# Altium schematic sheet Integration_Power.SchDoc
size A; SheetNumber: 1; SheetTotal: 1
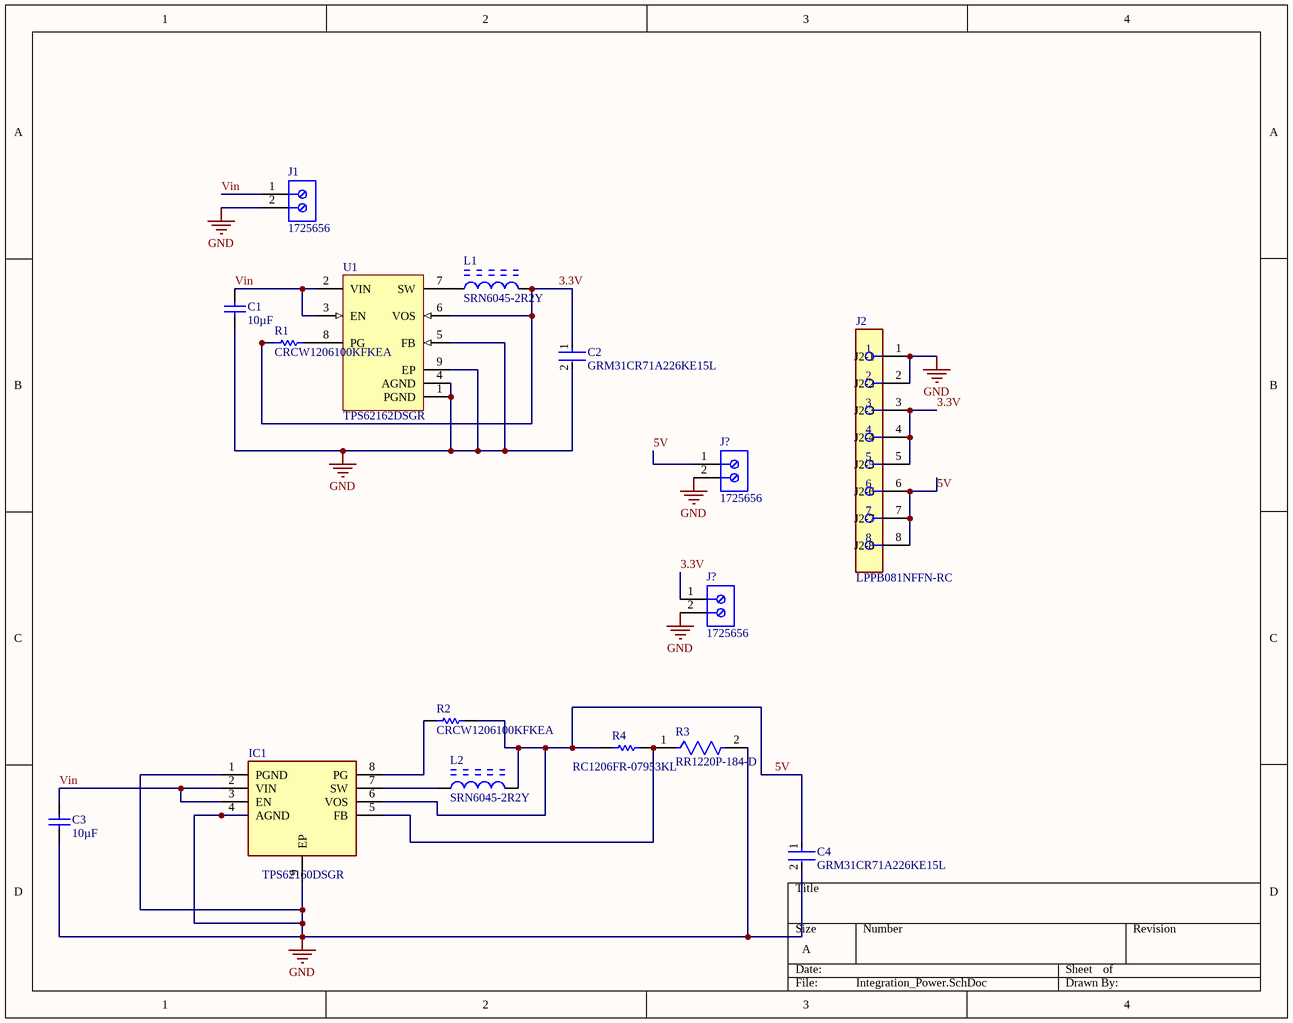
[diagram p0: Integration_Power.SchDoc]

## Parts
(Parts that share a designator on the sheet are numbered #1, #2 ... from top to bottom, then left to right.)
C1  Capacitance: 10µF  [CAPC3216X180X55LL20T25]  (hidden comment: GRM31CR71C106KAC7L)
C2  GRM31CR71A226KE15L  [FP-GRM31C-0_2-e0_3_0_8-MFG]
C3  Capacitance: 10µF  [CAPC3216X180X55LL20T25]  (hidden comment: GRM31CR71C106KAC7L)
C4  GRM31CR71A226KE15L  [FP-GRM31C-0_2-e0_3_0_8-MFG]
IC1  TPS62160DSGR  [SON50P200X200X80-9N]
J1  1725656  [PHOE-1725656-2]
J2  LPPB081NFFN-RC  [FP-LPPB081NFFN-RC-MFG]
J?#1  1725656  [PHOE-1725656-2]
J?#2  1725656  [PHOE-1725656-2]
L1  SRN6045-2R2Y  [BOUR-SRN6045_V]
L2  SRN6045-2R2Y  [BOUR-SRN6045_V]
R1  CRCW1206100KFKEA  [RESC3216X60X45NL10T20]
R2  CRCW1206100KFKEA  [RESC3216X60X45NL10T20]
R3  RR1220P-184-D  [FP-RR1220-IPC_B]
R4  RC1206FR-07953KL  [RESC3116X65X40NL10T20]
U1  TPS62162DSGR  [DSG0008A_V]

## Nets
GND: C1.1 C2.2 C3.1 C4.2 IC1.1(PGND) IC1.4(AGND) IC1.9(EP) J1.2 J2.1(J2-1) J2.2(J2-2) J?#1.2 J?#2.2 R3.2 U1.1(PGND) U1.4(AGND) U1.5(FB) U1.9(EP)
3.3V: C2.1 J2.3(J2-3) J2.4(J2-4) J2.5(J2-5) J?#2.1 L1.2 R1.1 U1.6(VOS)
5V: C4.1 IC1.6(VOS) J2.6(J2-6) J2.7(J2-7) J2.8(J2-8) J?#1.1 L2.2 R2.2 R4.1
Vin: C1.2 C3.2 IC1.2(VIN) IC1.3(EN) J1.1 U1.2(VIN) U1.3(EN)
NetIC1_5: IC1.5(FB) R3.1 R4.2
NetIC1_7: IC1.7(SW) L2.1
NetIC1_8: IC1.8(PG) R2.1
NetL1_1: L1.1 U1.7(SW)
NetR1_2: R1.2 U1.8(PG)

## Library data of the parts
C1 C3 = CMP-2000-06352-1: Chip Capacitor, 10 uF, +/- 10%, 16 V, -55 to 125 degC, 1206 (3216 Metric), RoHS, Tape and Reel; Manufacturer: Murata; Other Names: 490-3911-6; Product Training Modules: High-CapMultilayerCeramicCapacitors; Temperature Coefficient: X7R; Catalog Drawings: GRMSeries_1206_1.6; Featured Product: GA3SafetyRecognizedCapsandHi-CapMLCC; Online Catalog: GRMSeries; Voltage - Rated: 16V; Size / Dimension: 0.126"Lx0.063"W(3.20mmx1.60mm); Applications: GeneralPurpose; Package Description: 2-Pin Surface Mount Device, Body 3.2 x 1.6 mm; Datasheet Version: 03/2016; Package Reference: 1206; Manufacturer URL: http://www.murata.com/; Standard Package: 1; Mounting Type: SurfaceMount,MLCC; Thickness (Max): 0.071"(1.80mm); Category: Capacitors; Family: CeramicCapacitors; Lead Spacing: -; Tolerance: ±10%; Packaging: Digi-Reel®; Lead Style: -; Package / Case: 1206(3216Metric); Datasheet URL: http://search.murata.co.jp/Ceramy/image/img/A01X/G101/ENG/GRM31CR71C106KAC7-01.pdf; Operating Temperature: -55°C~125°C; Mounting Technology: SurfaceMount; Series: GRM; Ratings: -; Height - Seated (Max): -; Features: -; Parameter 1: *
C2 C4 = CMP-06035-003841-1: Chip Multilayer Ceramic Capacitors for General Purpose, 1206, 22uF, X7R, 15%, 10%, 10V; Height: 1.6mm; Width: 0.063inch; Min Operating Temperature: -55°C; Package Quantity: 1; Termination: SMD/SMT; Length: 3.2mm; Voltage Rating: 10V; Case/Package: 1206; Capacitance: 22uF; Case Code (Imperial): 1206; Depth: 1.6mm; Dielectric: X7R; Voltage: 10V; Material: Ceramic; Tolerance: 10%; Voltage Rating (DC): 10V; Lead Free: Lead Free; Max Operating Temperature: 125°C; Case Code (Metric): 3216; Packaging: Tape and Reel; Thickness: 0.071inch; Radiation Hardening: No; REACH SVHC: No SVHC; Mount: Surface Mount
IC1 = TPS62160DSGR: Integrated Circuit; Manufacturer_Name: Texas Instruments; Datasheet Link: http://www.ti.com/lit/gpn/tps62160; Height: 0.8mm; Manufacturer_Part_Number: TPS62160DSGR; Mouser Part Number: 595-TPS62160DSGR; Mouser Price/Stock: https://www.mouser.co.uk/ProductDetail/Texas-Instruments/TPS62160DSGR?qs=gXEV9p%2FxLgfRqf5wXx2iGg%3D%3D; Arrow Part Number: TPS62160DSGR; Arrow Price/Stock: https://www.arrow.com/en/products/tps62160dsgr/texas-instruments?region=nac
J1 J?#1 J?#2 = CMP-2000-05299-1: Male Header, Pitch 2.54 mm, 1 x 2 Position, Height 9 mm, Tail Length 3.5 mm; Manufacturer: Phoenix Contact; Number of contacts: 2; Content: 250pc(s); Pitch: 2.54mm; Industrial packaging: Yes; Colour: Green; Manufacturer part No.: 1725656; Type: MPT0,5/2-2,54; Datasheet URL: http://datasheet.octopart.com/1725656-Phoenix-Contact-datasheet-5302866.pdf; Manufacturer URL: http://www.phoenixcontact.com/; Datasheet Version: Apr-08
J2 = CMP-25680-000039-1: CONN HDR 8POS 0.05 GOLD PCB; Connector Type: Header; Pitch: 0.05inch; Number of Positions: 8; Packaging: Bulk; Contact Type: Female Socket; Termination: Solder; RoHS Compliant: Yes; Lead Free: Lead Free; Package Quantity: 1; Mount: Through Hole; Contact Plating: Gold; Number of Rows: 1
L1 L2 = CMP-2000-07142-1: Semi-Shielded Power Inductor, 2.2 uH, +/- 30%, 3.5 A, -40 to 125 degC, 2-Pin SMD, RoHS, Tape and Reel; Manufacturer: Bourns; Kits: SRN-LAB1-ND / -INDUCTORKIT; Other Names: SRN6045-2R2YCT; EDA / CAD Models: DownloadfromAcceleratedDesigns; Current Rating: 3.5A; 3D Model: SRN6045.stp; Q @ Freq: 15@7.96MHz; Frequency - Self Resonant: 35MHz; PCN Assembly/Origin: MagneticproductsOct/2013; Type: Wirewound; DC Resistance (DCR): 25.1mOhmMax; Product Training Modules: SRNSeries:Semi-ShieldedInductors; Frequency - Test: 100kHz; Inductance: 2.2µH; Online Catalog: SRNSeries; Material - Core: Ferrite; Current - Saturation: 6A; Size / Dimension: 0.236"Lx0.236"W(6.00mmx6.00mm); Operating Temperature: -40°C~125°C; Height - Seated (Max): 0.177"(4.50mm); Mounting Technology: SurfaceMount; Package Description: 2-Pin Surface Mounted Device, Body 6 x 6 mm; Series: SRN6045; Packaging: CutTape(CT); Mounting Type: SurfaceMount; Shielding: Shielded; Datasheet Version: 12/2014; Category: Inductors,Coils,Chokes; Datasheet URL: http://www.bourns.com/docs/Product-Datasheets/SRN6045.pdf; Standard Package: 1; Manufacturer URL: http://www.bourns.com/; Package Reference: SRN6045; RoHS Information: SRN6045SeriesMaterialDeclaration; Family: FixedInductors; Package / Case: Nonstandard; Tolerance: ±30%
R1 R2 = CMP-1014-00736-2: Manufacturer: Vishay Dale; Part Number: CRCW1206100KFKEA
R3 = CMP-2001-03296-2: 180kΩ ±0.5% 0.1W 1/10W Chip Resistor 0805 (2012 Metric) Thin Film; Voltage Rating: 100V; Temperature Coefficient: 25ppm/°C; Max Power Dissipation: 100mW; Resistance: 180kR; Termination: SMD/SMT; Length: 2mm; RoHS Compliant: Yes; Width: 0.049inch; Package Quantity: 1; Tolerance: 0.5%; Mount: Surface Mount; Height - Seated (Max): 0.02inch; Case/Package: 0805; Case Code (Metric): 2012; Depth: 1.25mm; Technology: THIN FILM; Number of Terminations: 2; Max Operating Temperature: 125°C; Voltage Rating (DC): 100V; Packaging: Tape and Reel; Lead Free: Lead Free; Resistor Type: Thin Film; Height: 0.4mm; Power Rating: 100mW; Size Code: 0805; Min Operating Temperature: -55°C; Series: RR; Case Code (Imperial): 0805
R4 = CMP-1014-00847-2: Manufacturer: Yageo; Part Number: RC1206FR-07953KL
U1 = CMP-0323-00316-3: Buck Step Down Regulator with 3 to 17 V Input and 3.3 V Output, -40 to 85 degC, 8-Pin WSON (DSG), Green (RoHS & no Sb/Br); Manufacturer: Texas Instruments; SubFamily: Step-Down Regulator; Synchronous Rectification: TRUE; Vout(Max)(V): 3.3; Regulated Outputs(#): 1; Switch Current Limit(Typ)(A): 1.8; Duty Cycle(Max)(%): 100; Iq(Typ)(mA): 0.017; Rating: Catalog; Vin(Min)(V): 3; Vin(Max)(V): 17; ComponentLink2URL: http://www.ti.com/litv/pdf/mpds308a; ComponentLink3URL: Samples URL:http://www.ti.com/product/tps62162#samples; Eco-Plan: Green (RoHS & no Sb/Br); PackageDescription: 8-Pin Plastic Small Outline No-Lead, 2 x 2 x 0.8 mm Body, 0.5 mm Pitch, Exposed Pad; DatasheetVersion: SLVSAM2A; Topology: Buck; PartNumber: TPS62162DSGR; PackageReference: DSG0008A; ComponentLink1URL: http://www.ti.com/general/docs/lit/getliterature.tsp?genericPartNumber=TPS62162&fileType=pdf; PackageVersion: revB, Oct-2010; Mounting Technology: Surface Mount; Code_JEDEC: MO-229; Iout(Max)(A): 1; ComponentLink1Description: Datasheet; ComponentLink2Description: Package Specification; Vout(Min)(V): 3.3; ComponentLink3Description: URL Link1; Preset Vout(V): 3.3